# EAGLE design USBasp (EAGLE 9.0.1)
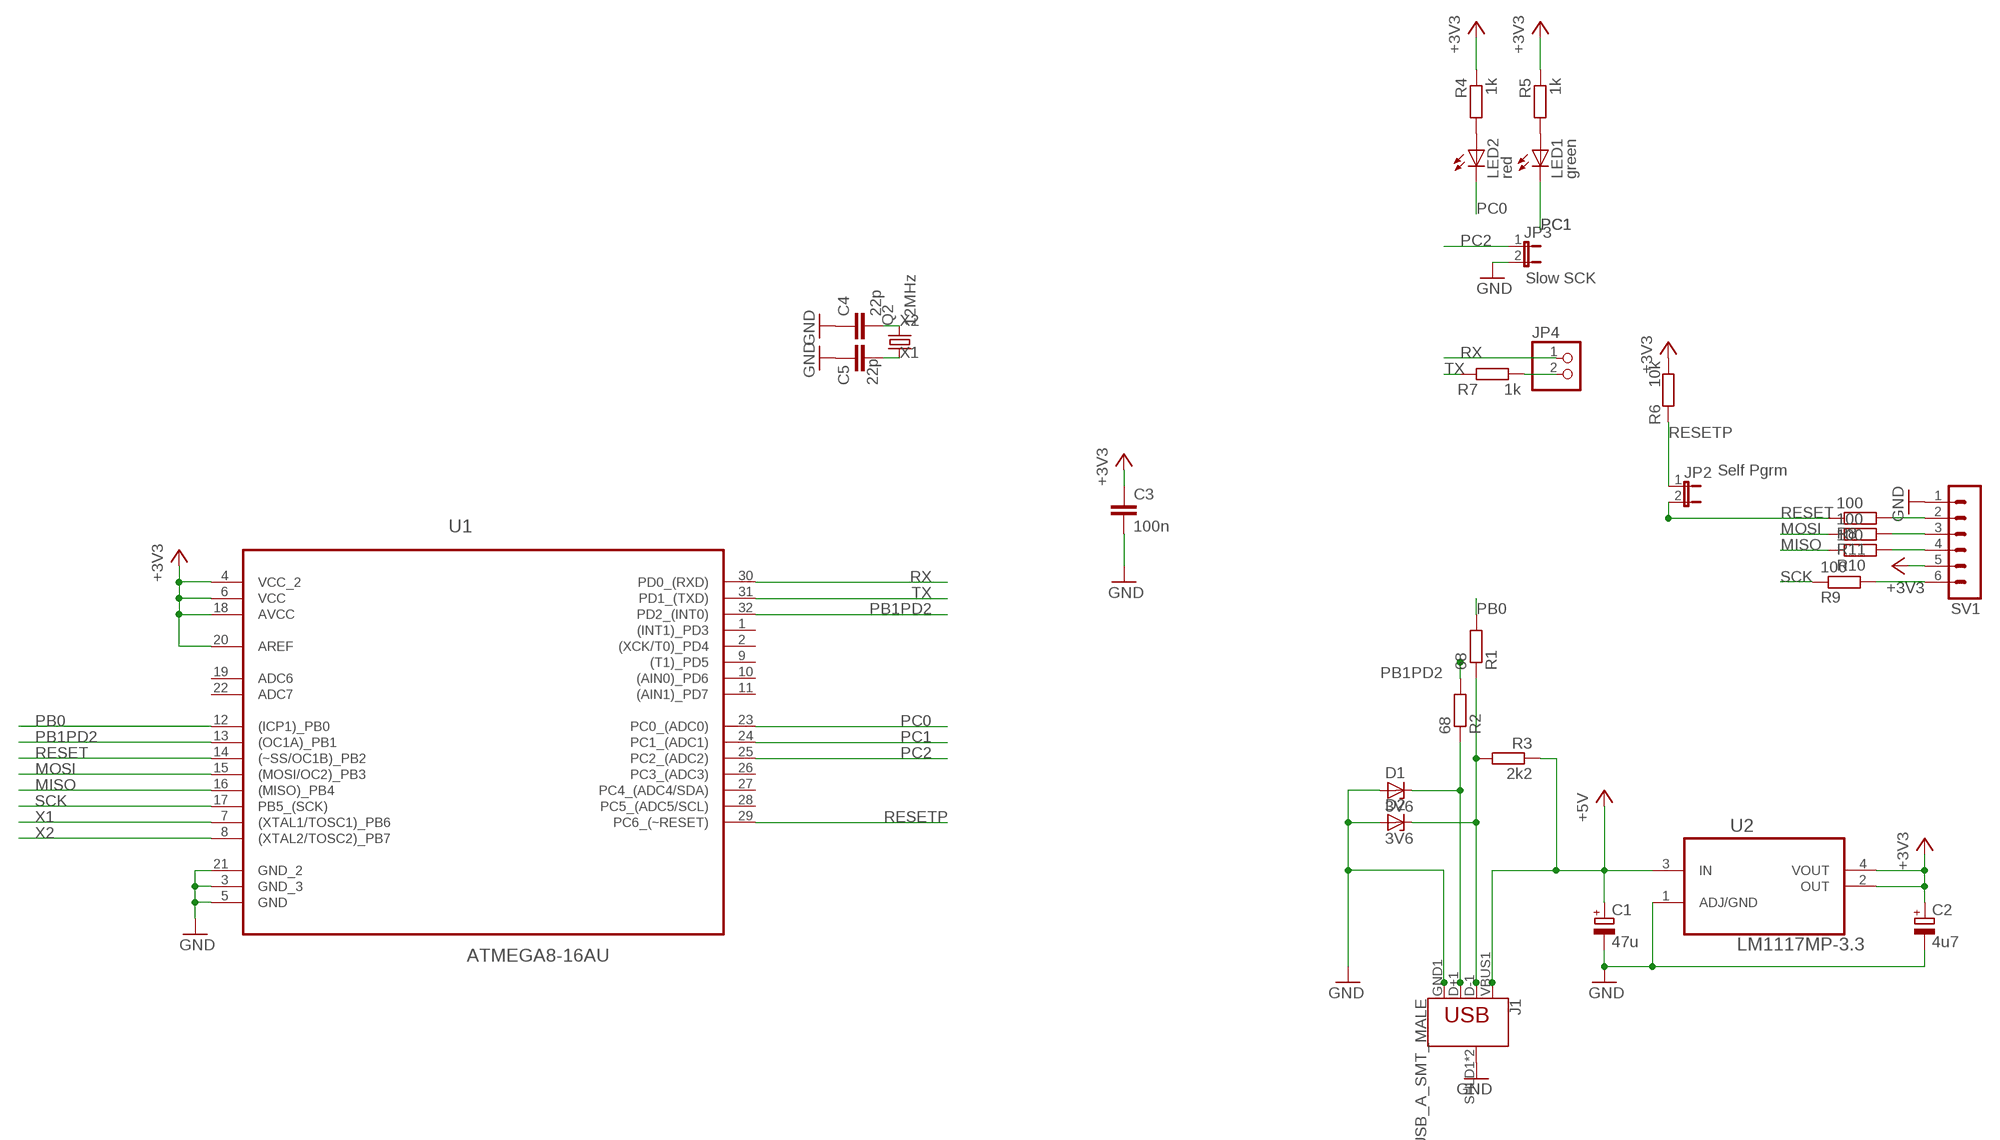
[diagram p0: schematic, sheet 1]

## Parts
C1  47u  CPOL-EUETR4  [ETR4]
C2  4u7  CPOL-EUE2.5-5  [E2,5-5]
C3  100n  C-EUC0603  [C0603]
C4  22p  C-EUC0603  [C0603]
C5  22p  C-EUC0504  [C0504]
D1  3V6  ZENER-DIODESOD80C  [SOD80C]
D2  3V6  ZENER-DIODESOD80C  [SOD80C]
J1  USB_A_SMT_MALE  [USB-A-SMT-MALE]
JP2  Self Pgrm  JP1E  [JP1]
JP3  Slow SCK  JP1E  [JP1]
JP4  PINHD-1X2  [1X02]
LED1  green  LEDCHIP-LED0603  [CHIP-LED0603]
LED2  red  LEDCHIP-LED0603  [CHIP-LED0603]
Q2  12MHz  CRYSTALHC49S  [HC49/S]
R1  68  R-EU_R0603  [R0603]
R2  68  R-EU_R0603  [R0603]
R3  2k2  R-EU_R0603  [R0603]
R4  1k  R-EU_R0603  [R0603]
R5  1k  R-EU_R0603  [R0603]
R6  10k  R-EU_R0603  [R0603]
R7  1k  R-EU_R0603  [R0603]
R8  100  R-EU_R0603  [R0603]
R9  100  R-EU_R0603  [R0603]
R10  100  R-EU_R0603  [R0603]
R11  100  R-EU_R0603  [R0603]
SV1  MA06-1  [MA06-1]
U1  ATMEGA8-16AU  [QFP80P900X900X120-32N]
U2  LM1117MP-3.3  [SOT230P696X180-4N]

## Nets
+3V3: C2.+ C3.1 R4.1 R5.1 R6.1 SV1.5 U1.4(VCC_2) U1.6(VCC) U1.18(AVCC) U1.20(AREF) U2.2(OUT) U2.4(VOUT)
+5V: C1.+ J1.VBUS1(VBUS) R3.1 U2.3(IN)
GND: C1.- C2.- C3.2 C4.1 C5.1 D1.A D2.A J1.GND1(GND) J1.SHLD1(SHIELD) J1.SHLD2(SHIELD) JP3.2 SV1.1 U1.3(GND_3) U1.5(GND) U1.21(GND_2) U2.1(ADJ/GND)
MISO: R10.1 U1.16((MISO)_PB4)
MOSI: R11.1 U1.15((MOSI/OC2)_PB3)
N$5: D2.C J1.D-1(D-) R1.1 R3.2
N$8: D1.C J1.D+1(D+) R2.1
N$10: JP4.2 R7.1
N$13: LED2.A R4.2
N$18: R8.2 SV1.2
N$19: R9.2 SV1.6
N$20: R10.2 SV1.4
N$21: R11.2 SV1.3
N$25: LED1.A R5.2
PB0: R1.2 U1.12((ICP1)_PB0)
PB1PD2: R2.2 U1.13((OC1A)_PB1) U1.32(PD2_(INT0))
PC0: LED2.C U1.23(PC0_(ADC0))
PC1: LED1.C U1.24(PC1_(ADC1))
PC2: JP3.1 U1.25(PC2_(ADC2))
RESET: JP2.2 R8.1 U1.14((~SS/OC1B)_PB2)
RESETP: JP2.1 R6.2 U1.29(PC6_(~RESET))
RX: JP4.1 U1.30(PD0_(RXD))
SCK: R9.1 U1.17(PB5_(SCK))
TX: R7.2 U1.31(PD1_(TXD))
X1: C5.2 Q2.1 U1.7((XTAL1/TOSC1)_PB6)
X2: C4.2 Q2.2 U1.8((XTAL2/TOSC2)_PB7)
Unconnected: U1.1((INT1)_PD3) U1.2((XCK/T0)_PD4) U1.9((T1)_PD5) U1.10((AIN0)_PD6) U1.11((AIN1)_PD7) U1.19(ADC6) U1.22(ADC7) U1.26(PC3_(ADC3)) U1.27(PC4_(ADC4/SDA)) U1.28(PC5_(ADC5/SCL))

## Library data of the parts
C1 C2 = rcl:CPOL-EU: POLARIZED CAPACITOR, European symbol
C3-C5 = rcl:C-EU: CAPACITOR, European symbol
D1 D2 = diode:ZENER-DIODE: Z-Diode
J1 = SparkFun-Connectors:USB_A: USB-A Connector Male and female variants, as well as PTH and SMT variants SparkFun Products: SparkFun XBee Explorer Dongle <https://www.sparkfun.com/products/11697> PTH Male SparkFun MicroView-USB Programmer <https://www.sparkfun.com/products/12924> SMT Male SparkFun USB Type A Female Breakout <https://www.sparkfun.com/products/12700> SMT Female; PROD_ID: CONN-11499
JP2 JP3 = jumper:JP1E: JUMPER
JP4 = pinhead:PINHD-1X2: PIN HEADER
LED1 LED2 = led:LED: LED OSRAM: - CHIPLED LG R971, LG N971, LY N971, LG Q971, LY Q971, LO R971, LY R971 LH N974, LH R974 LS Q976, LO Q976, LY Q976 LO Q996 - Hyper CHIPLED LW Q18S LB Q993, LB Q99A, LB R99A - SideLED LS A670, LO A670, LY A670, LG A670, LP A670 LB A673, LV A673, LT A673, LW A673 LH A674 LY A675 LS A676, LA A676, LO A676, LY A676, LW A676 LS A679, LY A679, LG A679 - Hyper Micro SIDELED® LS Y876, LA Y876, LO Y876, LY Y876 LT Y87S - SmartLED LW L88C, LW L88S LB L89C, LB L89S, LG L890 LS L89K, LO L89K, LY L89K LS L896, LA L896, LO L896, LY L896 - TOPLED LS T670, LO T670, LY T670, LG T670, LP T670 LSG T670, LSP T670, LSY T670, LOP T670, LYG T670 LG T671, LOG T671, LSG T671 LB T673, LV T673, LT T673, LW T673 LH T674 LS T676, LA T676, LO T676, LY T676, LB T676, LH T676, LSB T676, LW T676 LB T67C, LV T67C, LT T67C, LS T67K, LO T67K, LY T67K, LW E67C LS E67B, LA E67B, LO E67B, LY E67B, LB E67C, LV E67C, LT E67C LW T67C LS T679, LY T679, LG T679 LS T770, LO T770, LY T770, LG T770, LP T770 LB T773, LV T773, LT T773, LW T773 LH T774 LS E675, LA E675, LY E675, LS T675 LS T776, LA T776, LO T776, LY T776, LB T776 LHGB T686 LT T68C, LB T68C - Hyper Mini TOPLED® LB M676 - Mini TOPLED Santana® LG M470 LS M47K, LO M47K, LY M47K Source: http://www.osram.convergy.de/
Q2 = crystal:CRYSTAL: CRYSTAL; OC_FARNELL: 1667008; OC_NEWARK: unknown
R1-R11 = rcl:R-EU_: RESISTOR, European symbol
SV1 = con-lstb:MA06-1: PIN HEADER; OC_FARNELL: unknown; OC_NEWARK: unknown
U1 = Atmel_By_element14_Batch_1-00:ATMEGA8-16AU: 8-bit with 8KBytes In-System Programmable Flash; MPN: ATMEGA8-16AU; OC_FARNELL: 9171371; OC_NEWARK: 68T3193; PACKAGE: QFP-32; SUPPLIER: Atmel
U2 = NSC_By_element14_Batch_1.1:LM1117MP-3.3: Linear regulators; MPN: LM1117MP-3.3; OC_FARNELL: 9778195; OC_NEWARK: 41K3470; PACKAGE: SOT223-3; SUPPLIER: NationalSemiconductor

## Board
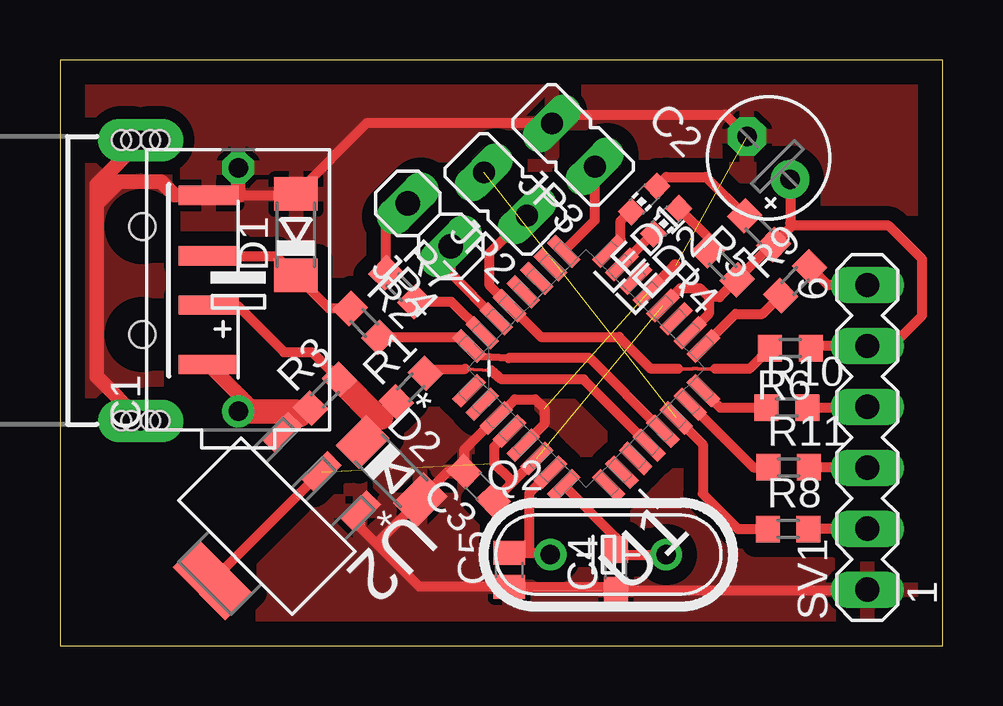
[diagram p1: board, top side]

Size 36.81 x 24.44 mm. Coordinates in mm from the lower left corner, seen from the top.
Outline: 0,0 36.81,0 36.81,24.44 0,24.44 0,0
Copper layers (1*16): Top 0.035mm / dielectric 1.5mm / Bottom 0.035mm
Design rules "default": minimum track width 6mil, minimum drill 0.35mm, track to track 6mil, track to pad 6mil, pad to pad 6mil, via to via 6mil, smd to smd 6mil, copper to edge 40mil, drill to drill 6mil, minimum pad ring 10mil, minimum via ring 8mil, stop-mask expansion 4mil, vias tented up to drill 0mil, thermal gap 10mil

### Footprints (pad centres in the part's own frame; a part is rotated, then mirrored left to right if it is on the bottom)
ETR4 = drill 0.813: + -5.08,0 | drill 0.813 octagon: - 5.08,0
E2,5-5 = drill 0.813 pad 1.6: + -1.27,0 | drill 0.813 pad 1.6 octagon: - 1.27,0
C0603 = smd 1.1 x 1: 1 -0.85,0; 2 0.85,0
C0504 = smd 1 x 1.3: 1 -0.7,0; 2 0.7,0
SOD80C = smd 1.4 x 1.8: A 1.7,0; C -1.7,0
USB-A-SMT-MALE = smd 2.5 x 0.8: D+1 10.95,1.027; D-1 10.95,-1.027; GND1 10.95,3.551; VBUS1 10.95,-3.5 | drill 0.8 pad 1.778 long: SHLD1 8.13,-5.85; SHLD2 8.13,5.85 | hole 1.1: 8.2,2.25; 8.2,-2.25 | hole 0.8: 8.53,-5.85; 8.93,-5.85; 7.73,-5.85; 7.33,-5.85; 8.53,5.85; 8.93,5.85; 7.73,5.85; 7.33,5.85
JP1 = drill 0.914 long: 1 0,-1.27; 2 0,1.27
1X02 = drill 1.016 long: 1 -1.27,0; 2 1.27,0
CHIP-LED0603 = smd 0.8 x 0.8: A 0,-0.75; C 0,0.75
HC49/S = drill 0.813: 1 -2.413,0; 2 2.413,0
R0603 = smd 1 x 1.1: 1 -0.85,0; 2 0.85,0
MA06-1 = drill 1.016 long: 1 -6.35,0; 2 -3.81,0; 3 -1.27,0; 4 1.27,0; 5 3.81,0; 6 6.35,0
QFP80P900X900X120-32N = smd 1.473 x 0.508: 1 -4.115,2.794; 2 -4.115,2.007; 3 -4.115,1.194; 4 -4.115,0.406; 5 -4.115,-0.406; 6 -4.115,-1.194; 7 -4.115,-2.007; 8 -4.115,-2.794; 17 4.115,-2.794; 18 4.115,-2.007; 19 4.115,-1.194; 20 4.115,-0.406; 21 4.115,0.406; 22 4.115,1.194; 23 4.115,2.007; 24 4.115,2.794 | smd 0.508 x 1.473: 9 -2.794,-4.115; 10 -2.007,-4.115; 11 -1.194,-4.115; 12 -0.406,-4.115; 13 0.406,-4.115; 14 1.194,-4.115; 15 2.007,-4.115; 16 2.794,-4.115; 25 2.794,4.115; 26 2.007,4.115; 27 1.194,4.115; 28 0.406,4.115; 29 -0.406,4.115; 30 -1.194,4.115; 31 -2.007,4.115; 32 -2.794,4.115
SOT230P696X180-4N = smd 1.6 x 0.838: 1 -3.2,2.311; 2 -3.2,0; 3 -3.2,-2.311 | smd 1.6 x 3.099: 4 3.2,0

### Placement (x,y rotation side)
C1  7.43,14.86 90 top
C2  29.54,20.36 135 top
C3  17.46,6.67 135 top
C4  23.18,3.17 90 top
C5  18.73,3.17 90 top
D1  9.83,17.15 90 top
D2  13.82,7.3 315 top
J1  -4.76,15.24 0 top
JP2  18.57,18.85 45 top
JP3  21.4,20.89 45 top
JP4  15.4,17.56 135 top
LED1  24.35,18.63 135 top
LED2  25.27,17.72 135 top
Q2  22.86,3.81 0 top
R1  14.62,10.78 45 top
R2  12.69,13.47 315 top
R3  11.05,10.51 45 top
R4  27.62,15.88 135 top
R5  29.15,17.34 135 top
R6  30.44,12.42 180 top
R7  14.19,14.95 315 top
R8  30.35,4.88 0 top
R9  30.64,15.21 45 top
R10  30.3,9.94 0 top
R11  30.38,7.45 0 top
SV1  33.66,8.7 90 top
U1  21.94,11.57 45 top
U2  8.62,5 225 top

### Tracks (layer width: path | path; a pad name or v marks a point on that pad's centre or on a via)
+3V3  (2 unrouted)
  Top 0.406: U1.4 18.1,8.31 18.1,7.62 18.76,6.96 18.76,6.71 | U1.6 18.76,6.71 | 18.76,6.71 18.12,6.07 C3.1 | U1.20 25.86,14.92 26.67,14.92 27.05,14.54 | 27.05,14.54 27.05,13.85 U1.18 | 27.05,14.54 27.49,14.54 R4.1 29.68,16.73 R5.1 30.54,17.53 | 30.54,17.53 34.54,17.53 35.94,16.13 35.94,13.78 34.67,12.51 SV1.5 31.38,12.51 R6.1 | C2.+ 30.44,17.62 30.54,17.53 | U2.4 U2.2
+5V
  Top 0.406: 5.47,11.74 J1.VBUS1 | 8.01,9.91 10.26,9.91 | 10.26,9.91 R3.1 | U2.3 9.99,9.63 10.26,9.91
  Top 0.61: J1.VBUS1 8.15,9.78 8.19,9.78
  Top 1.016: C1.+ 8.19,9.78 9.84,9.78 9.99,9.63
GND  (2 unrouted)
  Top 0.406: U1.5 20.19,9.25 20.19,9.91 19.81,10.29 18.96,10.29 U1.3 16.86,8.19 C3.2 16.19,7.27 D2.A 13.27,4.35 13.11,4.35 | 13.11,4.35 14.98,2.47 C5.1 23.03,2.47 C4.1 33.63,2.32 SV1.1 | J1.GND1 7.49,18.79 9.78,18.79 D1.A 12.78,21.79 JP3.2 20.87,22.16 27.74,22.16 C2.- | U2.1 12.52,4.94 13.11,4.35
  Top 0.508: U1.21 25.65,15.86 25.65,15.88
  Top 0.61: C1.- 7.43,18.85 7.49,18.79 | J1.SHLD1 1.52,11.23 1.52,18.41 | 1.52,18.41 1.52,19.25 J1.SHLD2 | J1.GND1 4.78,18.79 4.21,19.36 2.47,19.36 1.52,18.41
  pour Top (isolate 0.61): 0.06,24.45 37.02,24.45 37.02,0 0.06,0
MISO
  Top 0.406: U1.16 27.52,9.94 R10.1
MOSI
  Top 0.406: U1.15 28.9,7.45 R11.1
N$5
  Top 0.406: R1.1 13.38,9.54 12.51,8.66 12.61,8.55 D2.C | J1.D-1 7.38,14.21 9.34,12.25 10.51,12.25 R3.2
  Top 1.016: R3.2 13.23,9.54 13.38,9.54
N$8
  Top 0.406: J1.D+1 9.02,16.27 D1.C 11.21,14.07 R2.1
N$10
  Top 0.406: R7.1 13.59,17.55 JP4.2
N$13
  Top 0.406: LED2.A 27.02,17.03 R4.2
N$18
  Top 0.406: SV1.2 33.64,4.88 R8.2
N$19
  Top 0.406: SV1.6 32.01,15.05 R9.2
N$20
  Top 0.406: R10.2 33.63,9.94 SV1.4
N$21
  Top 0.406: SV1.3 33.64,7.45 R11.2
N$25
  Top 0.406: LED1.A 25.28,19.56 26.92,19.56 R5.2
PB0
  Top 0.15: 17.97,11.49 16.89,11.56
  Top 0.406: R1.2 15.19,11.38 15.41,11.53 15.43,11.53 16.89,11.56 | U1.12 21.82,11.11 18.41,11.11 17.97,11.49
PB1PD2
  Top 0.305: 18.7,12 17.59,12.06 17.15,12.51
  Top 0.406: R2.2 16.69,12.87 U1.32 17.15,12.51 | U1.13 22.08,12 18.7,12
PC0
  Top 0.406: U1.23 24.71,17.19 LED2.C
PC1
  Top 0.406: U1.24 23.37,16.96 23.37,17.72 23.76,18.11 LED1.C
PC2
  Top 0.406: U1.25 22.3,17.75 JP3.1
RESET  (1 unrouted)
  Top 0.406: U1.14 26.8,8.4 26.8,6.35 28.27,4.88 R8.1
RESETP
  Top 0.152: 27.3,11.56 26.59,11.56 26.58,11.57 26.39,11.57 26.37,11.56 25.78,11.56
  Top 0.406: JP2.1 17.91,16.39 17.91,15.03 U1.29 20.04,12.89 23.3,12.89 24.64,11.56 25.78,11.56 | R6.2 28.73,11.56 27.3,11.56
RX
  Top 0.406: U1.30 16.29,15.53 JP4.1
SCK
  Top 0.406: U1.17 28.16,13.84 29.27,13.84 R9.1
TX
  Top 0.406: U1.31 16.32,14.35 R7.2
X1
  Top 0.406: C5.2 19.56,3.88 | 19.56,3.88 20.38,3.88 Q2.1 | U1.7 19.56,6.36 19.56,3.88
X2
  Top 0.406: Q2.2 23.39,3.81 C4.2 23.18,4.51 U1.8